# EAGLE schematic sBoardUS+ (EAGLE 6.5.0)
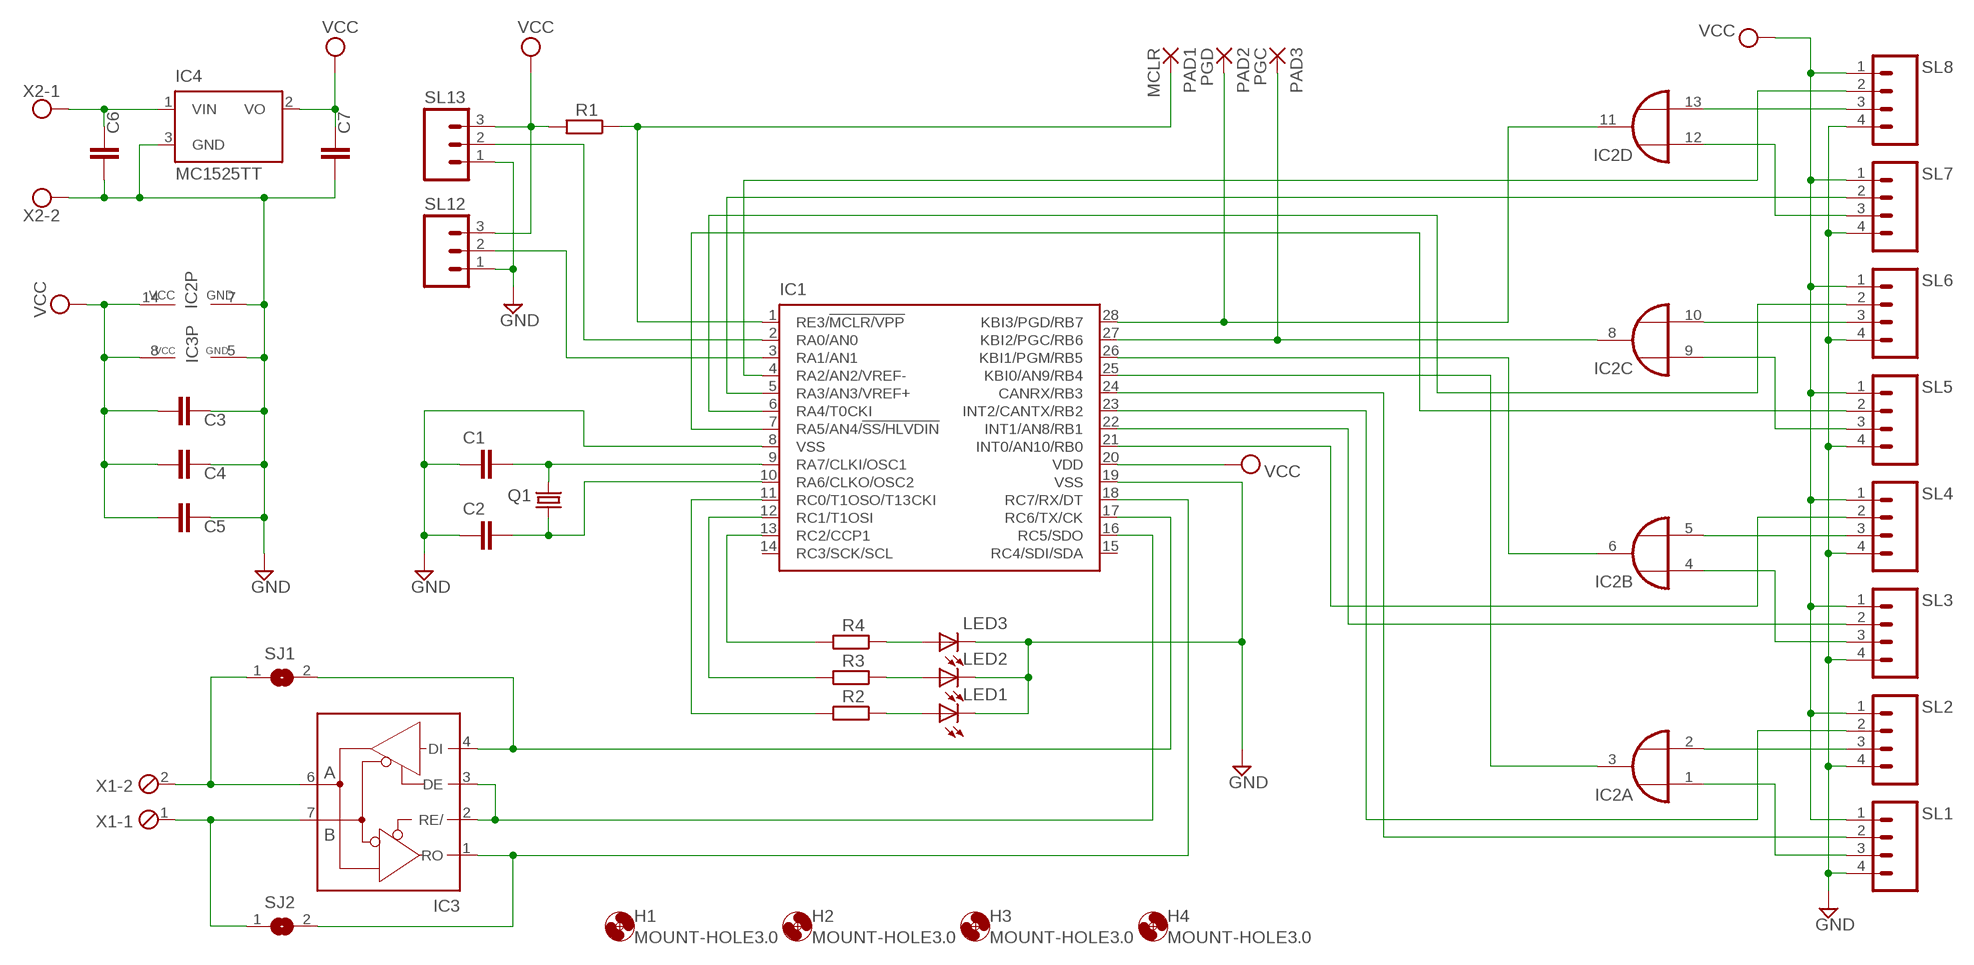
[diagram p0: schematic, sheet 1]

## Parts
C1  C-EUC0805  [C0805]
C2  C-EUC0805  [C0805]
C3  C-EUC0805  [C0805]
C4  C-EUC0805  [C0805]
C5  C-EUC0805  [C0805]
C6  C-EUC0805  [C0805]
C7  C-EUC0805  [C0805]
H1  MOUNT-HOLE3.0  [3,0]
H2  MOUNT-HOLE3.0  [3,0]
H3  MOUNT-HOLE3.0  [3,0]
H4  MOUNT-HOLE3.0  [3,0]
IC1  PIC18F2580-E/SO  [SO28W]
IC2  74AC32D  [SO14]
IC3  MAX481CSA  [SO08]
IC4  MC1525TT  [SOT23]
LED1  LED  [SMARTLED-TTW]
LED2  LED  [SMARTLED-TTW]
LED3  LED  [SMARTLED-TTW]
PAD1  MCLR  SMD2  [SMD1,27-2,54]
PAD2  PGD  SMD2  [SMD1,27-2,54]
PAD3  PGC  SMD2  [SMD1,27-2,54]
Q1  CRYSTALHC49UP  [HC49UP]
R1  R-EU_M2012  [M2012]
R2  R-EU_M2012  [M2012]
R3  R-EU_M2012  [M2012]
R4  R-EU_M2012  [M2012]
SJ1  SJ  [SJ]
SJ2  SJ  [SJ]
SL1  M04  [04P]
SL2  M04  [04P]
SL3  M04  [04P]
SL4  M04  [04P]
SL5  M04  [04P]
SL6  M04  [04P]
SL7  M04  [04P]
SL8  M04  [04P]
SL12  M03  [03P]
SL13  M03  [03P]
X1  MPT2  [2POL254]
X2  AK500/2  [AK500/2]

## Nets
GND: C1.1 C2.1 C3.1 C4.1 C5.1 C6.2 C7.2 IC1.8(VSS) IC1.19(VSS) IC2.7(P:GND) IC3.5(GND) IC4.3(GND) LED1.C@1(C) LED2.C@1(C) LED3.C@1(C) SL1.4 SL2.4 SL3.4 SL4.4 SL5.4 SL6.4 SL7.4 SL8.4 SL12.1 SL13.1 X2.2
N$1: C1.2 IC1.9(RA7/CLKI/OSC1) Q1.2
N$2: C2.2 IC1.10(RA6/CLKO/OSC2) Q1.1
N$3: IC2.5(B:I1) SL4.3
N$4: IC1.1(RE3/!MCLR/VPP) PAD1.1(P) R1.1
N$5: IC1.2(RA0/AN0) SL13.2
N$6: IC1.3(RA1/AN1) SL12.2
N$7: IC1.25(KBI0/AN9/RB4) IC2.3(A:O)
N$8: IC1.26(KBI1/PGM/RB5) IC2.6(B:O)
N$9: IC1.27(KBI2/PGC/RB6) IC2.8(C:O) PAD3.1(P)
N$10: IC1.28(KBI3/PGD/RB7) IC2.11(D:O) PAD2.1(P)
N$11: IC2.2(A:I1) SL2.3
N$12: IC2.13(D:I1) SL8.3
N$13: IC2.10(C:I1) SL6.3
N$14: IC2.12(D:I0) SL7.3
N$15: IC2.9(C:I0) SL5.3
N$16: IC2.4(B:I0) SL3.3
N$17: IC2.1(A:I0) SL1.3
N$18: IC1.22(INT1/AN8/RB1) SL3.2
N$19: IC1.5(RA3/AN3/VREF+) SL7.2
N$20: IC1.4(RA2/AN2/VREF-) SL8.2
N$21: IC1.6(RA4/T0CKI) SL6.2
N$22: IC1.7(RA5/AN4/!SS/HLVDIN) SL5.2
N$23: IC1.21(INT0/AN10/RB0) SL4.2
N$24: IC1.24(CANRX/RB3) SL1.2
N$25: IC3.6(A) SJ1.1 X1.2
N$26: IC3.7(B) SJ2.1 X1.1
N$27: IC1.16(RC5/SDO) IC3.2(RE/) IC3.3(DE)
N$28: IC1.17(RC6/TX/CK) IC3.4(DI) SJ1.2
N$29: IC1.18(RC7/RX/DT) IC3.1(RO) SJ2.2
N$30: IC1.23(INT2/CANTX/RB2) SL2.2
N$31: IC1.11(RC0/T1OSO/T13CKI) R2.2
N$32: IC1.12(RC1/T1OSI) R3.2
N$33: IC1.13(RC2/CCP1) R4.2
N$34: LED3.A@1(A) R4.1
N$35: LED2.A@1(A) R3.1
N$36: LED1.A@1(A) R2.1
N$37: C6.1 IC4.1(VIN) X2.1
VCC: C3.2 C4.2 C5.2 C7.1 IC1.20(VDD) IC2.14(P:VCC) IC3.8(VCC) IC4.2(VO) R1.2 SL1.1 SL2.1 SL3.1 SL4.1 SL5.1 SL6.1 SL7.1 SL8.1 SL12.3 SL13.3
Unconnected: IC1.14(RC3/SCK/SCL) IC1.15(RC4/SDI/SDA)

## Library data of the parts
C1-C7 = rcl:C-EU: CAPACITOR, European symbol
H1-H4 = holes:MOUNT-HOLE: MOUNTING HOLE with drill center marker
IC1 = microchip:PIC18F2*80: 28-Pin Enhanced Flash Microcontrollers with ECAN(TM) Technology 10-Bit A/D and nanoWatt Technology Source: http://www.microchip.com .. 39637a.pdf; MF: MICROCHIP; MPN: PIC18F2580-I/SO; OC_FARNELL: 9321284; OC_NEWARK: 71J7243
IC2 = 74xx-eu:74*32: Quad 2-input OR gate
IC3 = maxim:MAX481CSA: RS485 TRANSEIVER; MF: MAXIM; MPN: MAX481CSA; OC_FARNELL: unknown; OC_NEWARK: 90C3817
IC4 = microchip:MC15*: 2.5V and 4.096V Voltage References Source: http://www.microchip.com .. 21653b.pdf; OC_FARNELL: unknown; OC_NEWARK: unknown
LED1-LED3 = led:LED: LED OSRAM: - CHIPLED LG R971, LG N971, LY N971, LG Q971, LY Q971, LO R971, LY R971 LH N974, LH R974 LS Q976, LO Q976, LY Q976 LO Q996 - Hyper CHIPLED LW Q18S LB Q993, LB Q99A, LB R99A - SideLED LS A670, LO A670, LY A670, LG A670, LP A670 LB A673, LV A673, LT A673, LW A673 LH A674 LY A675 LS A676, LA A676, LO A676, LY A676, LW A676 LS A679, LY A679, LG A679 - Hyper Micro SIDELED® LS Y876, LA Y876, LO Y876, LY Y876 LT Y87S - SmartLED LW L88C, LW L88S LB L89C, LB L89S, LG L890 LS L89K, LO L89K, LY L89K LS L896, LA L896, LO L896, LY L896 - TOPLED LS T670, LO T670, LY T670, LG T670, LP T670 LSG T670, LSP T670, LSY T670, LOP T670, LYG T670 LG T671, LOG T671, LSG T671 LB T673, LV T673, LT T673, LW T673 LH T674 LS T676, LA T676, LO T676, LY T676, LB T676, LH T676, LSB T676, LW T676 LB T67C, LV T67C, LT T67C, LS T67K, LO T67K, LY T67K, LW E67C LS E67B, LA E67B, LO E67B, LY E67B, LB E67C, LV E67C, LT E67C LW T67C LS T679, LY T679, LG T679 LS T770, LO T770, LY T770, LG T770, LP T770 LB T773, LV T773, LT T773, LW T773 LH T774 LS E675, LA E675, LY E675, LS T675 LS T776, LA T776, LO T776, LY T776, LB T776 LHGB T686 LT T68C, LB T68C - Hyper Mini TOPLED® LB M676 - Mini TOPLED Santana® LG M470 LS M47K, LO M47K, LY M47K Source: http://www.osram.convergy.de LUXEON: - LUMILED® LXK2-PW12-R00, LXK2-PW12-S00, LXK2-PW14-U00, LXK2-PW14-V00 LXK2-PM12-R00, LXK2-PM12-S00, LXK2-PM14-U00 LXK2-PE12-Q00, LXK2-PE12-R00, LXK2-PE12-S00, LXK2-PE14-T00, LXK2-PE14-U00 LXK2-PB12-K00, LXK2-PB12-L00, LXK2-PB12-M00, LXK2-PB14-N00, LXK2-PB14-P00, LXK2-PB14-Q00 LXK2-PR12-L00, LXK2-PR12-M00, LXK2-PR14-Q00, LXK2-PR14-R00 LXK2-PD12-Q00, LXK2-PD12-R00, LXK2-PD12-S00 LXK2-PH12-R00, LXK2-PH12-S00 LXK2-PL12-P00, LXK2-PL12-Q00, LXK2-PL12-R00 Source: www.luxeon.com KINGBRIGHT: KA-3528ASYC Source: www.kingbright.com
PAD1-PAD3 = wirepad:SMD2: SMD PAD
Q1 = crystal:CRYSTAL: CRYSTAL; OC_FARNELL: unknown; OC_NEWARK: unknown
R1-R4 = rcl:R-EU_: RESISTOR, European symbol
SJ1 SJ2 = jumper:SJ: SMD solder JUMPER
SL1-SL8 = con-amp-quick:M04: AMP QUICK CONNECTOR; OC_FARNELL: unknown; OC_NEWARK: unknown
SL12 SL13 = con-amp-quick:M03: AMP QUICK CONNECTOR; OC_FARNELL: unknown; OC_NEWARK: unknown
X1 = con-phoenix-254:MPT2: PHOENIX CONNECTOR; OC_FARNELL: unknown; OC_NEWARK: unknown
X2 = con-ptr500:AK500/2: CONNECTOR; OC_FARNELL: unknown; OC_NEWARK: unknown